# Altium schematic sheet ESP32_SRAM.SchDoc: ESP32 et ENREGISTREMENT DES EVENEMENTS
size A4; CheckedBy: P. FISCHER; Author: A. LANDREAU et P. FISCHER; CompanyName: LE GROUPE DE 5; DrawnBy: A. LANDREAU et P. FISCHER; DocumentNumber: SCH_CARTE_MONITORING_PERMANENT_0; Revision: A.0; SheetNumber: 5; SheetTotal: 7
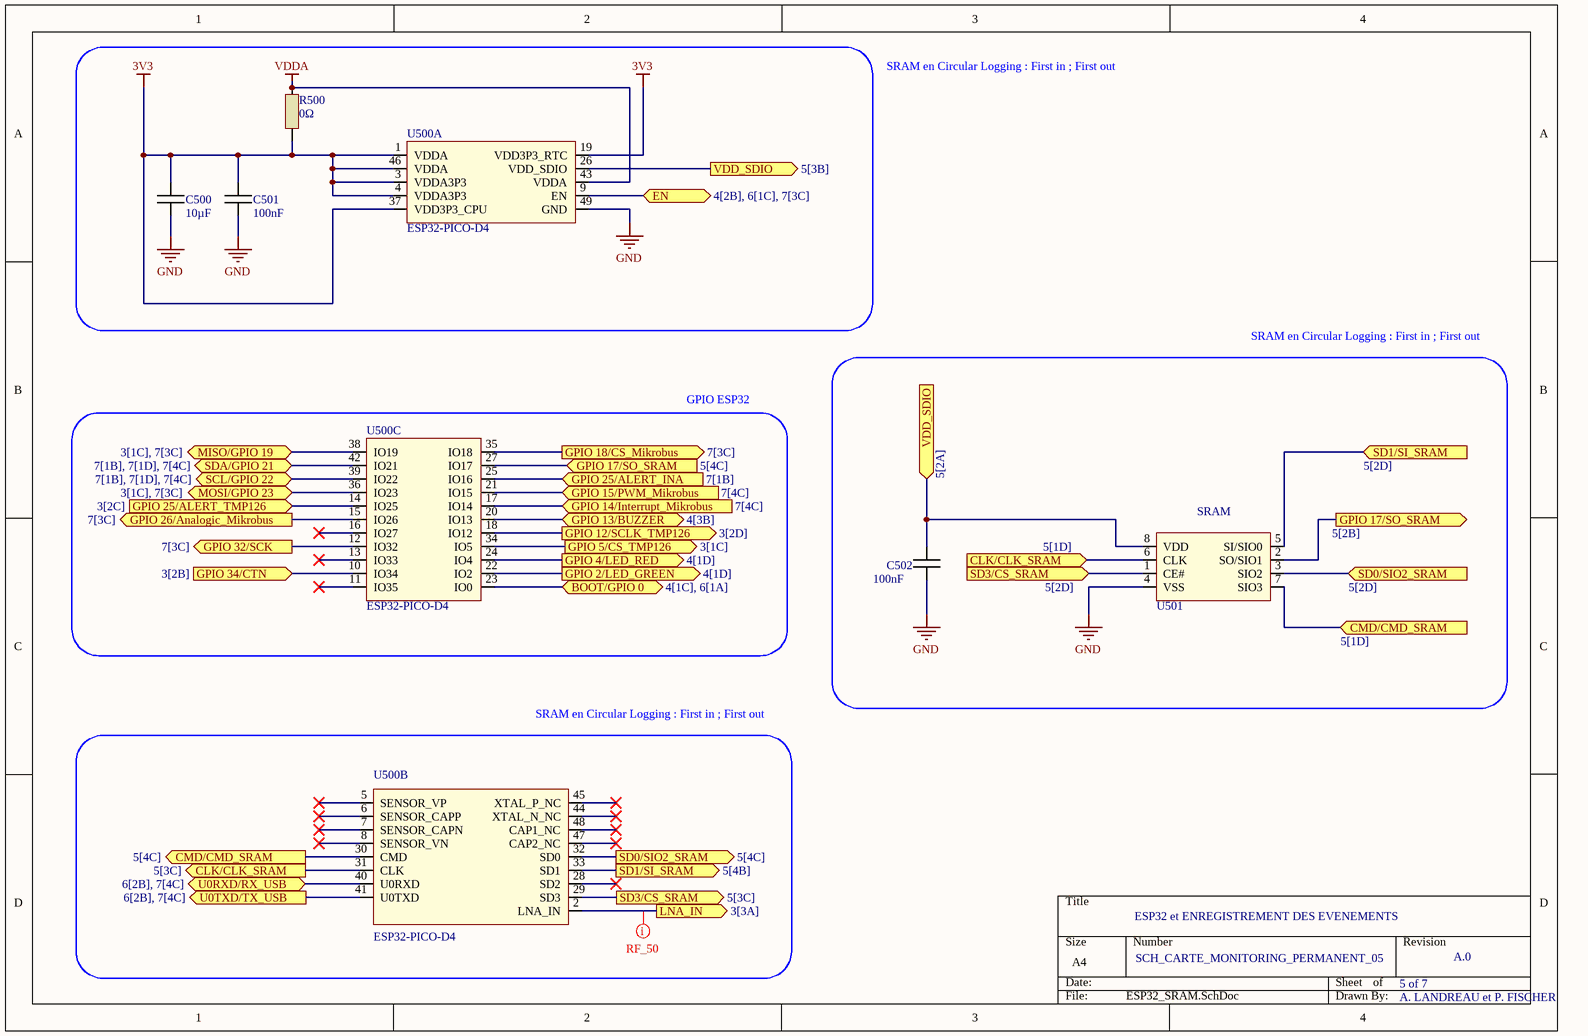
[diagram p0: ESP32_SRAM.SchDoc]

## Parts
C500  10µF  [CAPC1005X06N]
C501  100nF  [CAPC1005X06N]
C502  100nF  [CAPC1005X06N]
R500  0Ω  [RESC1005X06N]
U500  ESP32-PICO-D4  [PQFN50P700X700X104_HS-49N]  (parts A,B,C of 3)
U501  IS66WVS1M8BLL-104NLI  [SOIC127P600X175-8N]  (value not drawn)

## Blocks framed on the sheet
GPIO ESP32: U500
SRAM en Circular Logging : First in ; First out: U500

## Ports
BOOT/GPIO 0 (bidir, see 4[1C], 6[1A]), CLK/CLK_SRAM (in, see 5[1D]), CLK/CLK_SRAM (out, see 5[3C]), CMD/CMD_SRAM (in, see 5[1D]), CMD/CMD_SRAM (out, see 5[4C]), EN (bidir, see 4[2B], 6[1C], 7[3C]), GPIO 2/LED_GREEN (out, see 4[1D]), GPIO 4/LED_RED (out, see 4[1D]), GPIO 5/CS_TMP126 (out, see 3[1C]), GPIO 12/SCLK_TMP126 (out, see 3[2D]), GPIO 13/BUZZER (bidir, see 4[3B]), GPIO 14/Interrupt_Mikrobus (in, see 7[4C]), GPIO 15/PWM_Mikrobus (in, see 7[4C]), GPIO 17/SO_SRAM (in, see 5[4C]), GPIO 17/SO_SRAM (out, see 5[2B]), GPIO 18/CS_Mikrobus (out, see 7[3C]), GPIO 25/ALERT_INA (in, see 7[1B]), GPIO 25/ALERT_TMP126 (in, see 3[2C]), GPIO 26/Analogic_Mikrobus (out, see 7[3C]), GPIO 32/SCK (out, see 7[3C]), GPIO 34/CTN (in, see 3[2B]), LNA_IN (out, see 3[3A]), MISO/GPIO 19 (bidir, see 3[1C], 7[3C]), MOSI/GPIO 23 (bidir, see 3[1C], 7[3C]), SCL/GPIO 22 (bidir, see 7[1B], 7[1D], 7[4C]), SD0/SIO2_SRAM (in, see 5[2D]), SD0/SIO2_SRAM (out, see 5[4C]), SD1/SI_SRAM (in, see 5[2D]), SD1/SI_SRAM (out, see 5[4B]), SD3/CS_SRAM (in, see 5[2D]), SD3/CS_SRAM (out, see 5[3C]), SDA/GPIO 21 (bidir, see 7[1B], 7[1D], 7[4C]), U0RXD/RX_USB (bidir, see 6[2B], 7[4C]), U0TXD/TX_USB (out, see 6[2B], 7[4C]), VDD_SDIO (in, see 5[2A]), VDD_SDIO (out, see 5[3B])

## Nets
3V3: C500.1 C501.1 R500.1 U500.1(VDDA) U500.3(VDDA3P3) U500.4(VDDA3P3) U500.19(VDD3P3_RTC) U500.37(VDD3P3_CPU) U500.46(VDDA)
GND: C500.2 C501.2 C502.2 U500.49(GND) U501.4(VSS)
VDDA: R500.2 U500.43(VDDA)
BOOT/GPIO 0: U500.23(IO0) ; port BOOT/GPIO 0
CLK/CLK_SRAM: U500.31(CLK) U501.6(CLK) ; port CLK/CLK_SRAM
CMD/CMD_SRAM: U500.30(CMD) U501.7(SIO3) ; port CMD/CMD_SRAM
EN: U500.9(EN) ; port EN
GPIO 2/LED_GREEN: U500.22(IO2) ; port GPIO 2/LED_GREEN
GPIO 4/LED_RED: U500.24(IO4) ; port GPIO 4/LED_RED
GPIO 5/CS_TMP126: U500.34(IO5) ; port GPIO 5/CS_TMP126
GPIO 12/SCLK_TMP126: U500.18(IO12) ; port GPIO 12/SCLK_TMP126
GPIO 13/BUZZER: U500.20(IO13) ; port GPIO 13/BUZZER
GPIO 14/Interrupt_Mikrobus: U500.17(IO14) ; port GPIO 14/Interrupt_Mikrobus
GPIO 15/PWM_Mikrobus: U500.21(IO15) ; port GPIO 15/PWM_Mikrobus
GPIO 17/SO_SRAM: U500.27(IO17) U501.2(SO/SIO1) ; port GPIO 17/SO_SRAM
GPIO 18/CS_Mikrobus: U500.35(IO18) ; port GPIO 18/CS_Mikrobus
GPIO 25/ALERT_INA: U500.25(IO16) ; port GPIO 25/ALERT_INA
GPIO 25/ALERT_TMP126: U500.14(IO25) ; port GPIO 25/ALERT_TMP126
GPIO 26/Analogic_Mikrobus: U500.15(IO26) ; port GPIO 26/Analogic_Mikrobus
GPIO 32/SCK: U500.12(IO32) ; port GPIO 32/SCK
GPIO 34/CTN: U500.10(IO34) ; port GPIO 34/CTN
LNA_IN: U500.2(LNA_IN) ; port LNA_IN
MISO/GPIO 19: U500.38(IO19) ; port MISO/GPIO 19
MOSI/GPIO 23: U500.36(IO23) ; port MOSI/GPIO 23
SCL/GPIO 22: U500.39(IO22) ; port SCL/GPIO 22
SD0/SIO2_SRAM: U500.32(SD0) U501.3(SIO2) ; port SD0/SIO2_SRAM
SD1/SI_SRAM: U500.33(SD1) U501.5(SI/SIO0) ; port SD1/SI_SRAM
SD3/CS_SRAM: U500.29(SD3) U501.1(CE#) ; port SD3/CS_SRAM
SDA/GPIO 21: U500.42(IO21) ; port SDA/GPIO 21
U0RXD/RX_USB: U500.40(U0RXD) ; port U0RXD/RX_USB
U0TXD/TX_USB: U500.41(U0TXD) ; port U0TXD/TX_USB
VDD_SDIO: C502.1 U500.26(VDD_SDIO) U501.8(VDD) ; port VDD_SDIO

Not connected (* = marked no-connect by the designer): U500 5(SENSOR_VP)* 6(SENSOR_CAPP)* 7(SENSOR_CAPN)* 8(SENSOR_VN)* 11(IO35)* 13(IO33)* 16(IO27)* 28(SD2)* 44(XTAL_N_NC)* 45(XTAL_P_NC)* 47(CAP2_NC)* 48(CAP1_NC)*

## Layout directives
rule Width Constraint [Pref Impedance = 50.00ohms    Min Impedance = 50.00ohms    Max Impedance = 50.00ohms]: LNA_IN

## Notes on the sheet
- SRAM en Circular Logging : First in ; First out
- (near U501) SRAM

## Library data of the parts
C500-C502 = Capacitor
R500 = Resistor
U500 = ESP32: Système RF sur puce - SoC SIP module ESP32 with 4MByte Flash, Dual Core MCU, Wi-Fi & Bluetooth Combo, LGA48-pin, 7*7mm; Manufacturer 1: Espressif Systems; Supplier 1: Digi-Key; Supplier Part Number 1: 1904-1029-1-ND; Manufacturer Part Number 1: ESP32-PICO-D4
U501 = SRAM: SRAM 8Mb, SerialRAM, 2.7V-3.6V, 104MHz, 8 pin SOIC 150 mil, RoHS; Manufacturer 1: ISSI; Supplier 1: Digi-Key; Supplier Part Number 1: 706-IS66WVS1M8BLL-104NLI-ND; Manufactuer Part Number 1: IS66WVS1M8BLL-104NLI